# Altium project PCB_ProjectBatmobile Motor Control.PrjPcb
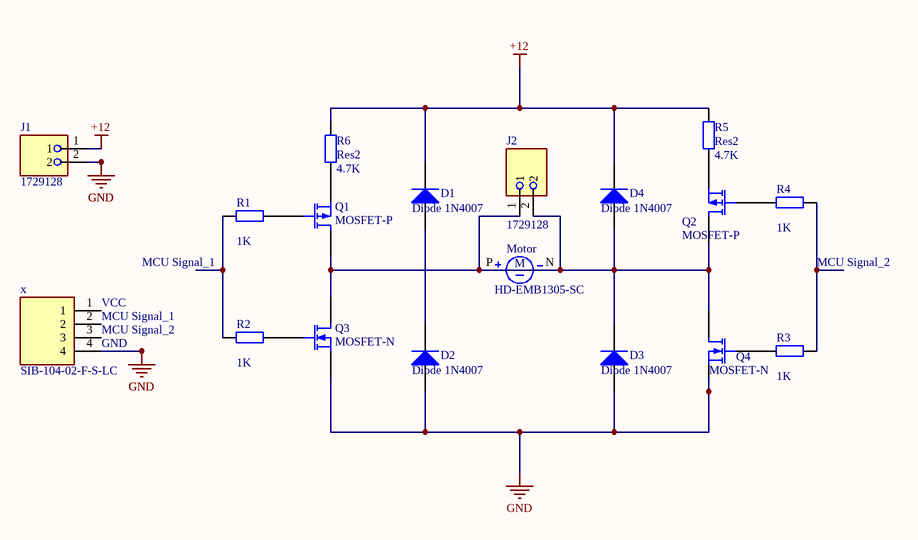
[diagram p0: H_Bridge.SchDoc]
1 sheet, 18 parts. Net scope: global (net labels, ports and power ports of the same name join across sheets).
Board file: PCB1.PcbDoc

## Sheet H_Bridge.SchDoc
size A4; SheetNumber: 1; SheetTotal: 1; SPICEModelCacheAWCMOMGX: <root> / <DocumentId>AWCMOMGX</DocumentId> / <CacheFrame Number="0"> / <Model Name="nmos" Kind="MDL"> / <Text>*Default N-Channel MOSFET / *Pinout: D,G,S / .MODEL NMOS NMOS()</Text> / </Model> / <Model Name="pmos" Kind="MDL"> / <Text>*Default P-Channel MOSFET / *Pinout: D,G,S / .MODEL PMOS PMOS()</Text> / </Model> / <Model Name="1n4007" Kind="MDL"> / <Text>*1N4007 MCE 8-16-95 / *1000V 1A Si GenPurpose Diode pkg:DIODE0.4 1,2 / .MODEL 1N4007 D(IS=2.55E-9 RS=0.042 N=1.75 TT=5.76E-6 CJO=1.85E-11 / + VJ=0.75 M=0.333 BV=1000 IBV=9.86E-5 )</Text> / </Model> / </CacheFrame> / </root>

### Parts
D1  Diode 1N4007  [DO-41]
D2  Diode 1N4007  [DO-41]
D3  Diode 1N4007  [DO-41]
D4  Diode 1N4007  [DO-41]
J1  1729128  [PHOENIX_1729128]
J2  1729128  [PHOENIX_1729128]
Motor  HD-EMB1305-SC  [PUI_HD-EMB1305-SC]
Q1  MOSFET-P  [E3]
Q2  MOSFET-P  [E3]
Q3  MOSFET-N  [E3]
Q4  MOSFET-N  [E3]
R1  value 1K  [AXIAL-0.4]  (hidden comment: Res2)
R2  value 1K  [AXIAL-0.4]  (hidden comment: Res2)
R3  value 1K  [AXIAL-0.4]  (hidden comment: Res2)
R4  value 1K  [AXIAL-0.4]  (hidden comment: Res2)
R5  Res2  value 4.7K  [AXIAL-0.4]
R6  Res2  value 4.7K  [AXIAL-0.4]
x  SIB-104-02-F-S-LC  [SAMTEC_SIB-104-02-F-S-LC]

### Nets
+12: D1.2(K) D4.2(K) J1.1 R5.2 R6.2
GND: D2.1(A) D3.1(A) J1.2 Q3.3(S) Q4.3(S) x.4
NetD1_1: D1.1(A) D2.2(K)
NetD3_2: D3.2(K) D4.1(A) J2.1 J2.2 Motor.N(NEG) Motor.P(POS) Q1.1(D) Q2.1(D) Q3.1(D) Q4.1(D)
NetQ1_2: Q1.2(G) R1.2
NetQ1_3: Q1.3(S) R6.1
NetQ2_2: Q2.2(G) R4.1
NetQ2_3: Q2.3(S) R5.1
NetQ3_2: Q3.2(G) R2.2
NetQ4_2: Q4.2(G) R3.1
NetR1_1: R1.1 R2.1
NetR3_2: R3.2 R4.2

Not connected (* = marked no-connect by the designer): x 1 2 3

### Notes on the sheet
- MCU Signal_1
- MCU Signal_2
- (near x) VCC
- (near x) GND
- (near x) MCU Signal_2
- (near x) MCU Signal_1
- (in symbol HD-EMB1305-SC) M

### Library data of the parts
D1-D4 = Diode 1N4007: 1 Amp General Purpose Rectifier; Published: 8-Jun-2000; LatestRevisionDate: 17-Jul-2002; LatestRevisionNote: Re-released for DXP Platform.; DatasheetVersion: 1998; PackageVersion: Aug-1999; PackageReference: DO-41; Publisher: Altium Limited; PackageDescription: Diode, Axial; Body 5.2 x 2.7 mm (LxDia. max), Lead Dia. 0.86 mm (max); Code_JEDEC: DO-204-AL; ComponentLink1Description: Manufacturer Link; ComponentLink1URL: http://www.fairchildsemi.com/; ComponentLink2Description: Datasheet; ComponentLink2URL: http://www.fairchildsemi.com/ds/1N%2F1N4001.pdf
J1 J2 = 1729128: PCB Terminal Screw 5.08mm 16AWG 400V 13.5A 2 Position COMBICON MKDSN Series | Phoenix Contact 1729128; SnapEDA_Link: https://www.snapeda.com/parts/1729128/Phoenix+Contact/view-part/?ref=snap; Package: None; Value: *; MF: Phoenix Contact; MP: 1729128; Check_prices: https://www.snapeda.com/parts/1729128/Phoenix+Contact/view-part/?ref=eda
Motor = HD-EMB1305-SC: HD MOTOR 3VDC 93OHM 13000RPM; MF: PUI Audio; SnapEDA_Link: https://www.snapeda.com/parts/HD-EMB1305-SC/PUI+Audio/view-part/?ref=snap; Package: None; Value: *; MP: HD-EMB1305-SC; Check_prices: https://www.snapeda.com/parts/HD-EMB1305-SC/PUI+Audio/view-part/?ref=eda
Q1 Q2 = MOSFET-P: P-Channel MOSFET; Published: 8-Jun-2000; LatestRevisionDate: 17-Jul-2002; LatestRevisionNote: Re-released for DXP Platform.; PackageVersion: 1995/1996; PackageReference: E3; Publisher: Altium Limited; PackageDescription: TO, Flat Index; 3 In-Line, Axial Leads; Body Dia. 4.6mm; Lead Dia. 0.5 mm (max)
Q3 Q4 = MOSFET-N: N-Channel MOSFET; Published: 8-Jun-2000; LatestRevisionDate: 17-Jul-2002; LatestRevisionNote: Re-released for DXP Platform.; PackageVersion: 1995/1996; PackageReference: E3; Publisher: Altium Limited; PackageDescription: TO, Flat Index; 3 In-Line, Axial Leads; Body Dia. 4.6mm; Lead Dia. 0.5 mm (max)
R1-R6 = Res2: Resistor; Published: 8-Jun-2000; LatestRevisionDate: 17-Jul-2002; LatestRevisionNote: Re-released for DXP Platform.; PackageReference: AXIAL-0.4; Publisher: Altium Limited; PackageDescription: Axial Device, Thru-Hole; 2 Leads; 0.4 in Pin Spacing
x = SIB-104-02-F-S-LC: SIB Series .100" One-Piece Interface; Availability: Unavailable; MP: SIB-104-02-F-S-LC; Value: *; Price: None; Package: None